# EAGLE design Headphones (EAGLE 7.7.0)
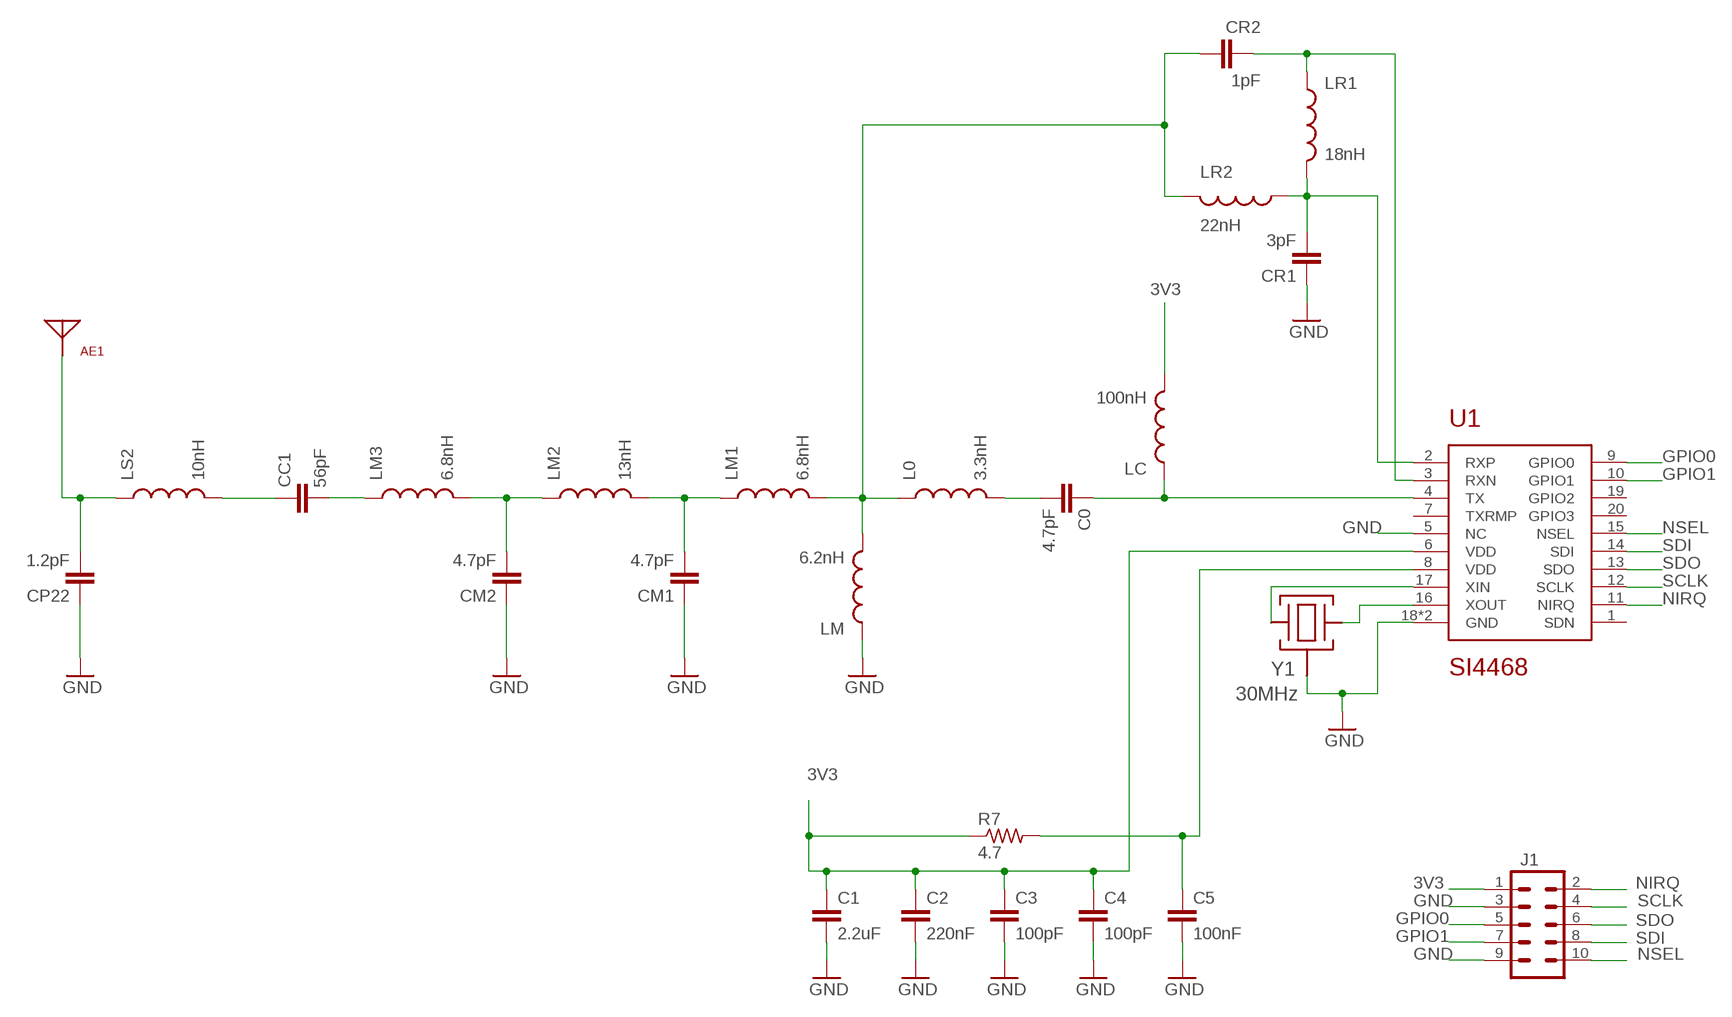
[diagram p0: schematic, sheet 1]

## Parts
AE1  ANT1204LL05R0915A  [ANT-1204]
C0  4.7pF  C-EUC0603  [C0603]
C1  2.2uF  C-EUC0603  [C0603]
C2  220nF  C-EUC0603  [C0603]
C3  100pF  C-EUC0603  [C0603]
C4  100pF  C-EUC0603  [C0603]
C5  100nF  C-EUC0603  [C0603]
CC1  56pF  C-EUC0603  [C0603]
CM1  4.7pF  C-EUC0603  [C0603]
CM2  4.7pF  C-EUC0603  [C0603]
CP22  1.2pF  C-EUC0603  [C0603]
CR1  3pF  C-EUC0603  [C0603]
CR2  1pF  C-EUC0603  [C0603]
J1  M05X2PTH  [AVR_ICSP]
L0  3.3nH  INDUCTOR0603  [0603]
LC  100nH  INDUCTOR0603  [0603]
LM  6.2nH  INDUCTOR0603  [0603]
LM1  6.8nH  INDUCTOR0603  [0603]
LM2  13nH  INDUCTOR0603  [0603]
LM3  6.8nH  INDUCTOR0603  [0603]
LR1  18nH  INDUCTOR0603  [0603]
LR2  22nH  INDUCTOR0603  [0603]
LS2  10nH  INDUCTOR0603  [0603]
R7  4.7  R-US_R0603  [R0603]
U1  SI4468  [QFN20-SI]
Y1  30MHz  ABM10-30-D30-T3  [ABM10]

## Nets
3V3: C1.1 C2.1 C3.1 C4.1 J1.1 LC.2 R7.1 U1.6(VDD)
GND: C1.2 C2.2 C3.2 C4.2 C5.2 CM1.1 CM2.1 CP22.1 CR1.1 J1.3 J1.9 LM.1 U1.5(NC) U1.18(GND) U1.21(GND) Y1.2(GND) Y1.4(GND)
GPIO0: J1.5 U1.9(GPIO0)
GPIO1: J1.7 U1.10(GPIO1)
N$1: U1.16(XOUT) Y1.1
N$2: U1.17(XIN) Y1.3
N$3: C0.2 L0.2
N$4: CR2.2 LR1.1 U1.3(RXN)
N$5: CR1.2 LR1.2 LR2.1 U1.2(RXP)
N$6: CR2.1 L0.1 LM1.2 LM.2 LR2.2
N$7: C5.1 R7.2 U1.8(VDD)
N$8: CC1.2 LM3.1
N$9 [50ohm]: CC1.1 LS2.2
N$10: C0.1 LC.1 U1.4(TX)
N$11: CM1.2 LM1.1 LM2.2
N$12: CM2.2 LM2.1 LM3.2
N$13: AE1.1(RF) CP22.2 LS2.1
NIRQ: J1.2 U1.11(NIRQ)
NSEL: J1.10 U1.15(NSEL)
SCLK: J1.4 U1.12(SCLK)
SDI: J1.8 U1.14(SDI)
SDO: J1.6 U1.13(SDO)
Unconnected: U1.1(SDN) U1.7(TXRMP) U1.19(GPIO2) U1.20(GPIO3)

## Library data of the parts
AE1 = Master:ANT1204LL05R0915A: Yageo Ceramic Chip Antenna - ANT1204LL05R0915A Specification: 915 MHz 50 Ohm 1W Max Power Datasheet: http://www.yageo.com/documents/recent/An_Ceramic_915_1204_CHE_0.pdf
C0 C1-C5 CC1 CM1 CM2 CP22 CR1 CR2 = resistor:C-EU: CAPACITOR, European symbol
J1 = SparkFun-Connectors:M05X2: Header 5x2 Standard 10-pin dual row 0.1" header. Commonly used with AVR-ISP. Use with Spark Fun Electronics SKU: PRT-00778
L0 LC LM LM1-LM3 LR1 LR2 LS2 = SparkFun-Passives:INDUCTOR: Inductors Basic Inductor/Choke - 0603 and 1206. Footprints are not proven and vary greatly between part numbers. INDUCTOR POWER 3.3UH 4.0A SMD 0.197" L x 0.197" W x 0.177" H (5.00mm x 5.00mm x 4.50mm)
R7 = resistor:R-US_: RESISTOR, American symbol
U1 = Master:SI4468: SI4468 - Low Current RF Transciever Specification: Max Output: +20dBm Max Data Rate: 1Mbps Power: 1.8 - 3.8 V Frequency Range: 142 - 1050 MHz
Y1 = Master:ABM10-30-D30-T3

## Net classes
1 50ohm: width 1.26 mm, clearance 0.25 mm

## Board
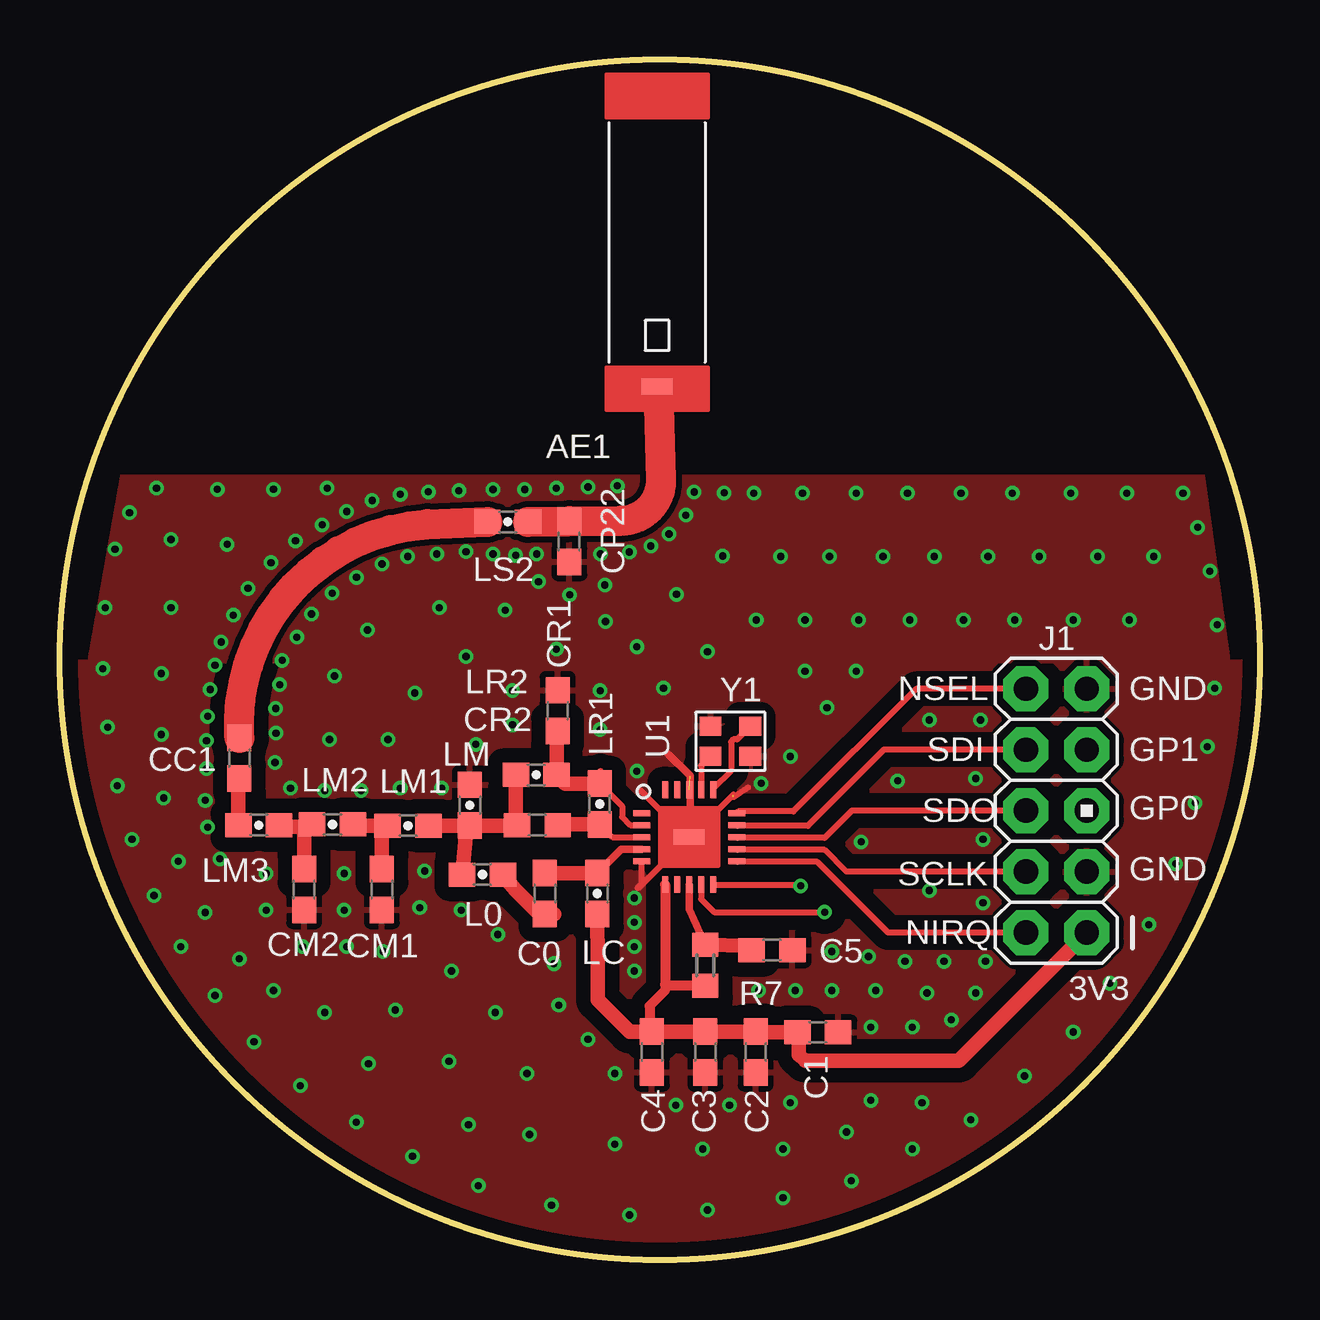
[diagram p1: board, top side]
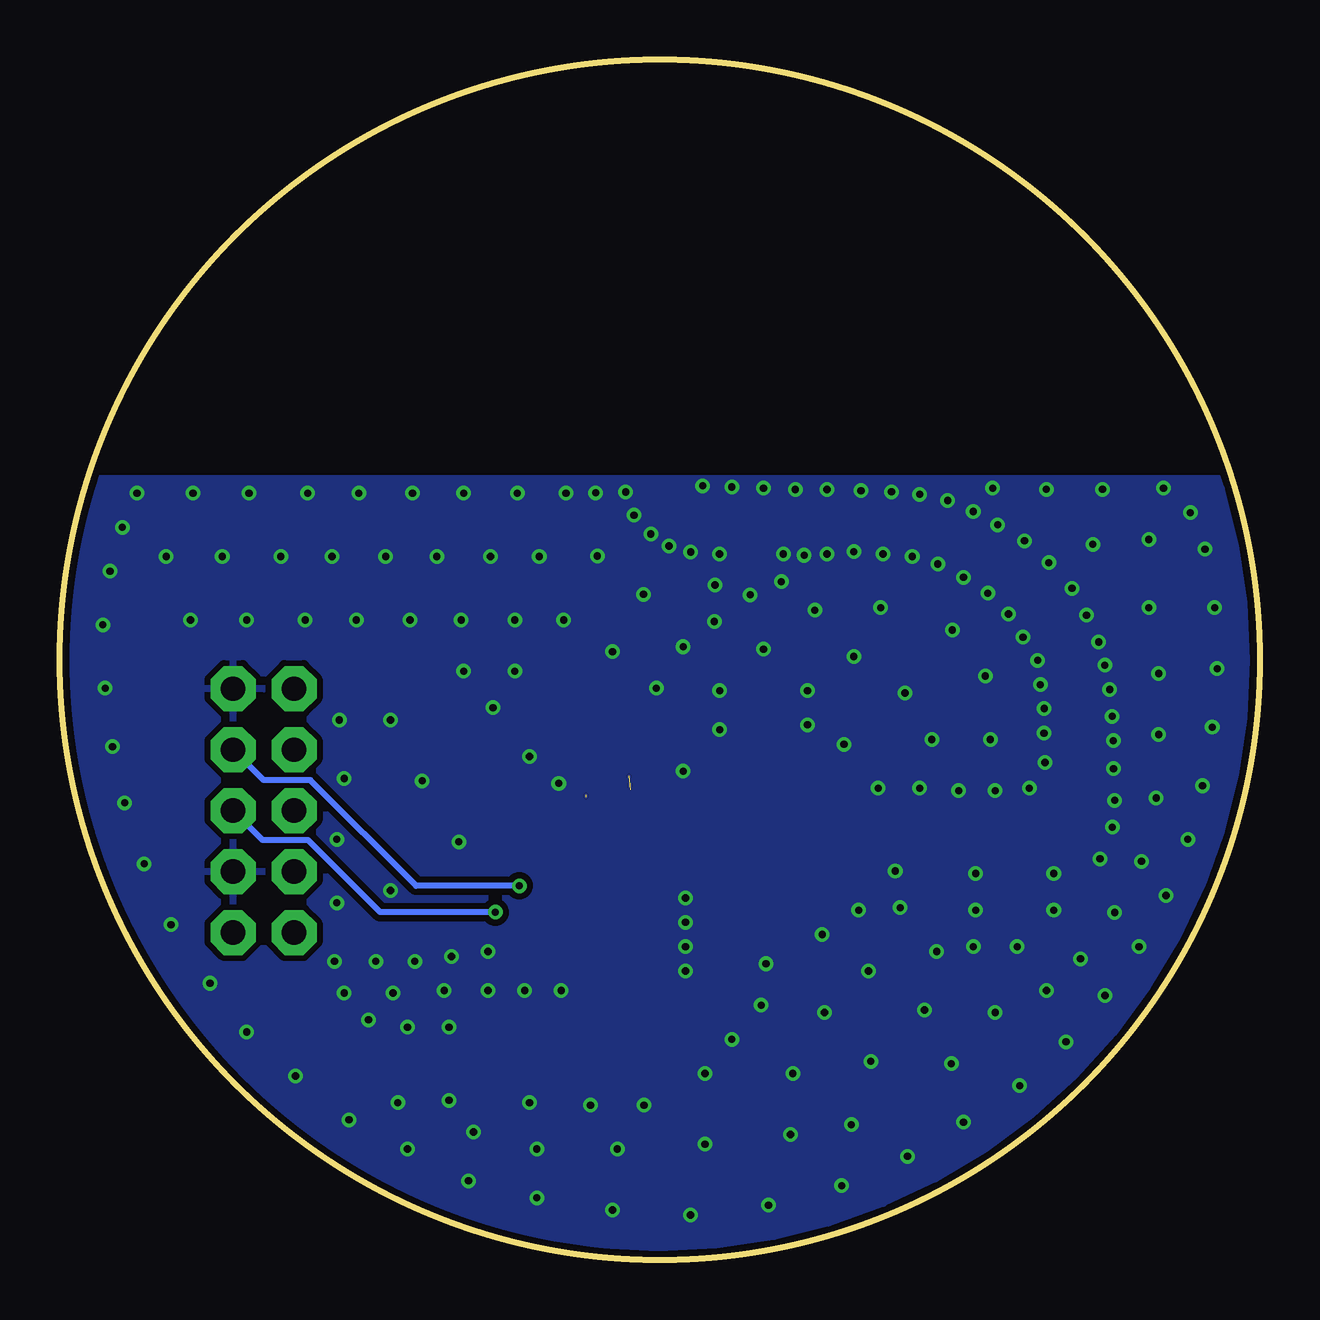
[diagram p2: board, bottom side, seen from below]

Size 50 x 50 mm. Coordinates in mm from the lower left corner, seen from the top.
Outline: circle at 25,25 radius 25
Copper layers (1*16): Top 0.035mm / dielectric 1.5mm / Bottom 0.035mm
Design rules "SeeedStudio_2layer_DRU_no_angle_20140221 *": minimum track width 6mil, minimum drill 8mil, track to track 6mil, track to pad 6mil, pad to pad 6mil, via to via 6mil, smd to smd 0mil, copper to edge 10mil, drill to drill 10mil, minimum pad ring 10mil, minimum via ring 6mil, stop-mask expansion 2mil, vias tented up to drill 12mil, thermal gap 10mil
tKeepout: area 1.5,33.1 to 49,50.6
bKeepout: area 1.5,33.1 to 49,50.6
tRestrict: area 1.5,33.1 to 49,50.6
bRestrict: area 1.5,33.1 to 49,50.6

### Footprints (pad centres in the part's own frame; a part is rotated, then mirrored left to right if it is on the bottom)
ANT-1204 = smd 0.635 x 1.27: 1 -6,0
C0603 = smd 1.1 x 1: 1 -0.85,0; 2 0.85,0
AVR_ICSP = drill 1.016 pad 1.88 octagon: 1 -1.27,5.08; 2 1.27,5.08; 3 -1.27,2.54; 4 1.27,2.54; 5 -1.27,0; 6 1.27,0; 7 -1.27,-2.54; 8 1.27,-2.54; 9 -1.27,-5.08; 10 1.27,-5.08
0603 = smd 1.1 x 1: 1 -0.85,0; 2 0.85,0
R0603 = smd 1 x 1.1: 1 -0.85,0; 2 0.85,0
QFN20-SI = smd 0.7 x 0.25: 1 -1.975,1; 2 -1.975,0.5; 3 -1.975,0; 4 -1.975,-0.5; 5 -1.975,-1; 11 1.975,-1; 12 1.975,-0.5; 13 1.975,0; 14 1.975,0.5; 15 1.975,1 | smd 0.25 x 0.7: 6 -1,-1.975; 7 -0.5,-1.975; 8 0,-1.975; 9 0.5,-1.975; 10 1,-1.975; 16 1,1.975; 17 0.5,1.975; 18 0,1.975; 19 -0.5,1.975; 20 -1,1.975 | smd 1.27 x 0.635: 21 0,0
ABM10 = smd 0.9 x 0.8: 1 -0.825,-0.625; 2 0.825,-0.625; 3 0.825,0.625; 4 -0.825,0.625

### Placement (x,y rotation side)
AE1  24.88,42.39 90 top
C0  20.2,15.26 270 top
C1  31.57,9.48 0 top
C2  28.98,8.66 270 top
C3  26.89,8.66 270 top
C4  24.67,8.66 270 top
C5  29.67,12.91 0 top
CC1  7.48,20.9 270 top
CM1  13.41,15.43 90 top
CM2  10.18,15.43 90 top
CP22  21.22,29.93 90 top
CR1  20.73,22.88 270 top
CR2  19.89,18.12 0 top
J1  41.51,18.72 180 top
L0  17.6,16.05 0 top
LC  22.39,15.26 270 top
LM  17.07,18.95 270 top
LM1  14.5,18.09 0 top
LM2  11.35,18.14 0 top
LM3  8.28,18.11 0 top
LR1  22.49,19 90 top
LR2  19.85,20.21 180 top
LS2  18.65,30.75 180 top
R7  26.89,12.27 90 top
U1  26.22,17.62 0 top
Y1  27.93,21.61 180 top

### Tracks (layer width: path | path; a pad name or v marks a point on that pad's centre or on a via)
3V3
  Top 0.406: U1.6 25.22,11.48 | 25.22,11.48 25.22,11.24 24.57,10.59 24.57,9.61 C4.1 | R7.1 25.27,11.42 arc-90 25.22,11.48
  Top 0.61: LC.2 22.41,12.36 22.41,10.84 23.74,9.51 C4.1 C3.1 C2.1 29.01,9.48 C1.1 30.79,9.41 30.79,8.55 31.04,8.3 37.45,8.3 J1.1
GND  (via drill 0.3)  (2 unrouted)
  Top 0.254: U1.21 24.09,15.49 24.06,15.49 24.24,15.67 U1.5 | 25.06,18.69 24.16,19.59 | 27.26,18.69 27.36,18.69 28.06,19.39 | 28.06,19.29 28.66,19.69
  Top 0.305: 26.27,18.74 26.27,20.16 25.35,21.08
  other vias: 9,21.94 9.15,23.97 9.26,24.98 9.87,25.95 10.48,26.91 11.34,27.78 12.35,28.44 13.42,29 14.49,29.3 15.7,29.41 16.92,29.51 18.04,29.41 19.86,29.41 23.93,15.08 23.93,14.07 23.93,13.05 23.93,12.03 22.52,29.41 23.22,32.25 22,32.2 20.68,32.15 19.36,32.1 18.04,32.1 16.62,32.05 15.35,32 14.18,31.9 13.01,31.64 11.94,31.19 10.93,30.63 9.81,29.96 8.8,29.05 7.83,27.98 7.22,26.86 6.72,25.75 6.46,24.78 6.26,23.77 6.16,22.65 6.1,21.64 29.21,19.86 24.03,20.37 29.11,11.22 30.64,11.22 22.51,23.72 22.51,22.09 18.85,23.72 18.85,22.3 20.68,25.45 17.33,21.48 15.9,19.65 14.18,19.65 9.61,19.65 8.96,20.73 11.03,19.55 12.55,19.55 8.59,16.1 8.59,14.57 10.11,13.05 11.84,16.1 11.84,14.57 32.16,12.85 32.16,11.22 33.79,9.7 35.51,9.7 37.14,10 38.15,11.12 38.56,12.44 36.83,12.44 35.21,12.44 33.68,12.64 33.99,11.22 36.12,11.12 30.43,20.98 13.47,12.85 11.94,13.05 23.72,29.49 25.69,27.73 27.61,29.33 25.38,30.24 27.68,31.96 26.08,31.03 26.43,32 28.91,31.95 30.94,31.95 33.18,31.95 35.31,31.95 37.55,31.95 39.68,31.95 42.12,31.95 44.45,31.95 46.79,31.95 34.9,19.96 38.15,20.06 33.38,17.42 38.46,17.52 38.46,14.88 36.22,22.5 38.36,22.5 36.22,15.39 11.13,32.15 8.9,32.1 6.56,32.1 4.02,32.15 2.9,31.14 2.29,29.61 1.88,27.17 1.78,24.63 1.99,22.19 2.39,19.76 3,17.52 3.92,15.18 5.03,13.05 6.46,11.02 8.08,9.09 10.01,7.26 12.35,5.74 14.69,4.31 17.43,3.09 20.48,2.28 23.73,1.87 26.98,2.08 30.13,2.59 32.97,3.3 35.51,4.62 37.95,5.84 40.19,7.67 42.22,9.49 43.74,11.53 45.37,13.96 46.49,16.5 47.3,19.04 47.81,21.38 48.11,23.82 48.21,26.46 47.91,28.7 47.4,30.53 14.99,14.68 15.19,16.2 16.72,14.57 18.24,13.56 20.58,12.34 25.15,23.82 20.78,10.61 22,9.19 23.12,7.77 25.66,6.45 27.89,6.45 30.43,6.55 30.03,29.31 32.06,29.31 34.29,29.31 36.43,29.31 38.66,29.31 40.8,29.31 43.23,29.31 45.57,29.31 29.01,26.66 31.04,26.66 33.28,26.66 35.41,26.66 37.65,26.66 39.78,26.66 42.22,26.66 44.56,26.66 31.04,24.53 33.18,24.53 31.96,23.01 26.98,25.34 24.03,25.55 22.7,28.12 18.55,27.07 15.8,27.17 12.82,26.25 11.44,24.32 11.23,21.69 13.67,21.69 14.79,23.62 16.92,25.14 16.31,12.03 13.97,10.41 11.03,10.31 4.63,27.17 6.96,29.81 4.63,30.02 4.22,24.43 4.22,21.89 6.1,20.47 6.05,19.15 6.15,18.03 6.66,16.71 4.32,19.25 4.93,16.61 6.05,14.47 7.47,12.54 8.89,11.22 12.86,8.17 16.21,8.28 18.14,10.31 19.46,7.77 17.02,5.63 19.56,5.23 23.12,4.82 26.78,4.62 30.13,4.62 32.77,5.33 35.92,6.55 33.79,6.65 24.62,29.74 18.99,29.36 19.94,28.26 21.24,27.71 22.73,26.6 8.99,22.97
  pour Bottom (isolate 0.254): 49.56,24.99 arc180 0.56,24.99 arc180
  pour Top (isolate 0.6, rank 4): 49.46,24.89 0.46,24.89 arc180
  pour Top (isolate 0.25): 1.26,24.99 48.66,24.99 47.56,32.99 2.66,32.89
GPIO0  (via drill 0.3)
  Top 0.254: U1.9 26.72,15.03 27.26,14.49 v31.86,14.49
  Bottom 0.254: v31.86,14.49 36.66,14.49 39.66,17.49 41.55,17.49 J1.5
GPIO1  (via drill 0.3)
  Top 0.254: U1.10 30.8,15.64 v30.86,15.59
  Bottom 0.254: v30.86,15.59 35.16,15.59 39.56,19.99 41.51,19.99 J1.7
N$1
  Top 0.254: Y1.1 28.21,21.69 28.06,21.69 27.96,21.59 27.96,20.39 27.22,19.64 U1.16
N$2
  Top 0.254: Y1.3 26.72,20.59 U1.17
N$3
  Top 0.61: L0.2 18.96,15.43 19.99,14.4 20.59,14.4 C0.2
N$4
  Top 0.254: LR1.1 23.02,17.62 U1.3
  Top 0.61: CR2.2 20.76,18.15 LR1.1
N$5
  Top 0.254: U1.2 23.77,18.12 23.42,18.46 23.42,18.91 LR1.2 21.98,19.85 22.51,20.38
  Top 0.61: 21.98,19.85 21.06,19.85 LR2.1 20.7,22 CR1.2
N$6
  Top 0.61: LR2.2 19,18.16 CR2.1 19.02,18.1 LM.2 16.95,18.08 | L0.1 16.95,18.08 | 16.95,18.08 15.67,18.08 LM1.2
N$7
  Top 0.305: U1.8 26.22,14.61 R7.2
  Top 0.61: R7.2 28.63,13.09 C5.1
N$8
  Top 0.61: LM3.1 7.43,19.91 CC1.2
N$9
  Top 1.26: CC1.1 arc-90 15.3,30.65 LS2.2
N$10
  Top 0.305: U1.4 23.39,17.12 LC.1
  Top 0.61: LC.1 C0.1
N$11
  Top 0.61: LM1.1 13.39,18.09 | 13.39,18.09 12.66,18.09 LM2.2 | CM1.2 13.41,18.06 13.39,18.09
N$12
  Top 0.61: LM2.1 10.09,18.04 | 10.09,18.04 9.5,18.04 LM3.2 | CM2.2 10.18,17.95 10.09,18.04
N$13
  Top 1.26: AE1.1 arc-90 24.95,36.33 25.05,32.5 arc-90 23.4,30.8 CP22.2 LS2.1
NIRQ
  Top 0.254: J1.2 34.51,13.64 31.56,16.59 28.22,16.59 U1.11
NSEL
  Top 0.254: J1.10 35.67,23.8 30.56,18.69 28.26,18.69 U1.15
SCLK
  Top 0.254: J1.4 32.77,16.18 31.86,17.09 28.22,17.09 U1.12
SDI
  Top 0.254: J1.8 34.33,21.26 31.16,18.09 28.22,18.09 U1.14
SDO
  Top 0.254: J1.6 32.99,18.72 31.86,17.59 28.22,17.59 U1.13

### Text on the board
tNames: NSEL | GND | SDI | GP1 | SDO | GP0 | SCLK | GND | NIRQ | 3V3